# EAGLE design utilidong-butt-mk-1.1 (EAGLE 6.5.0)
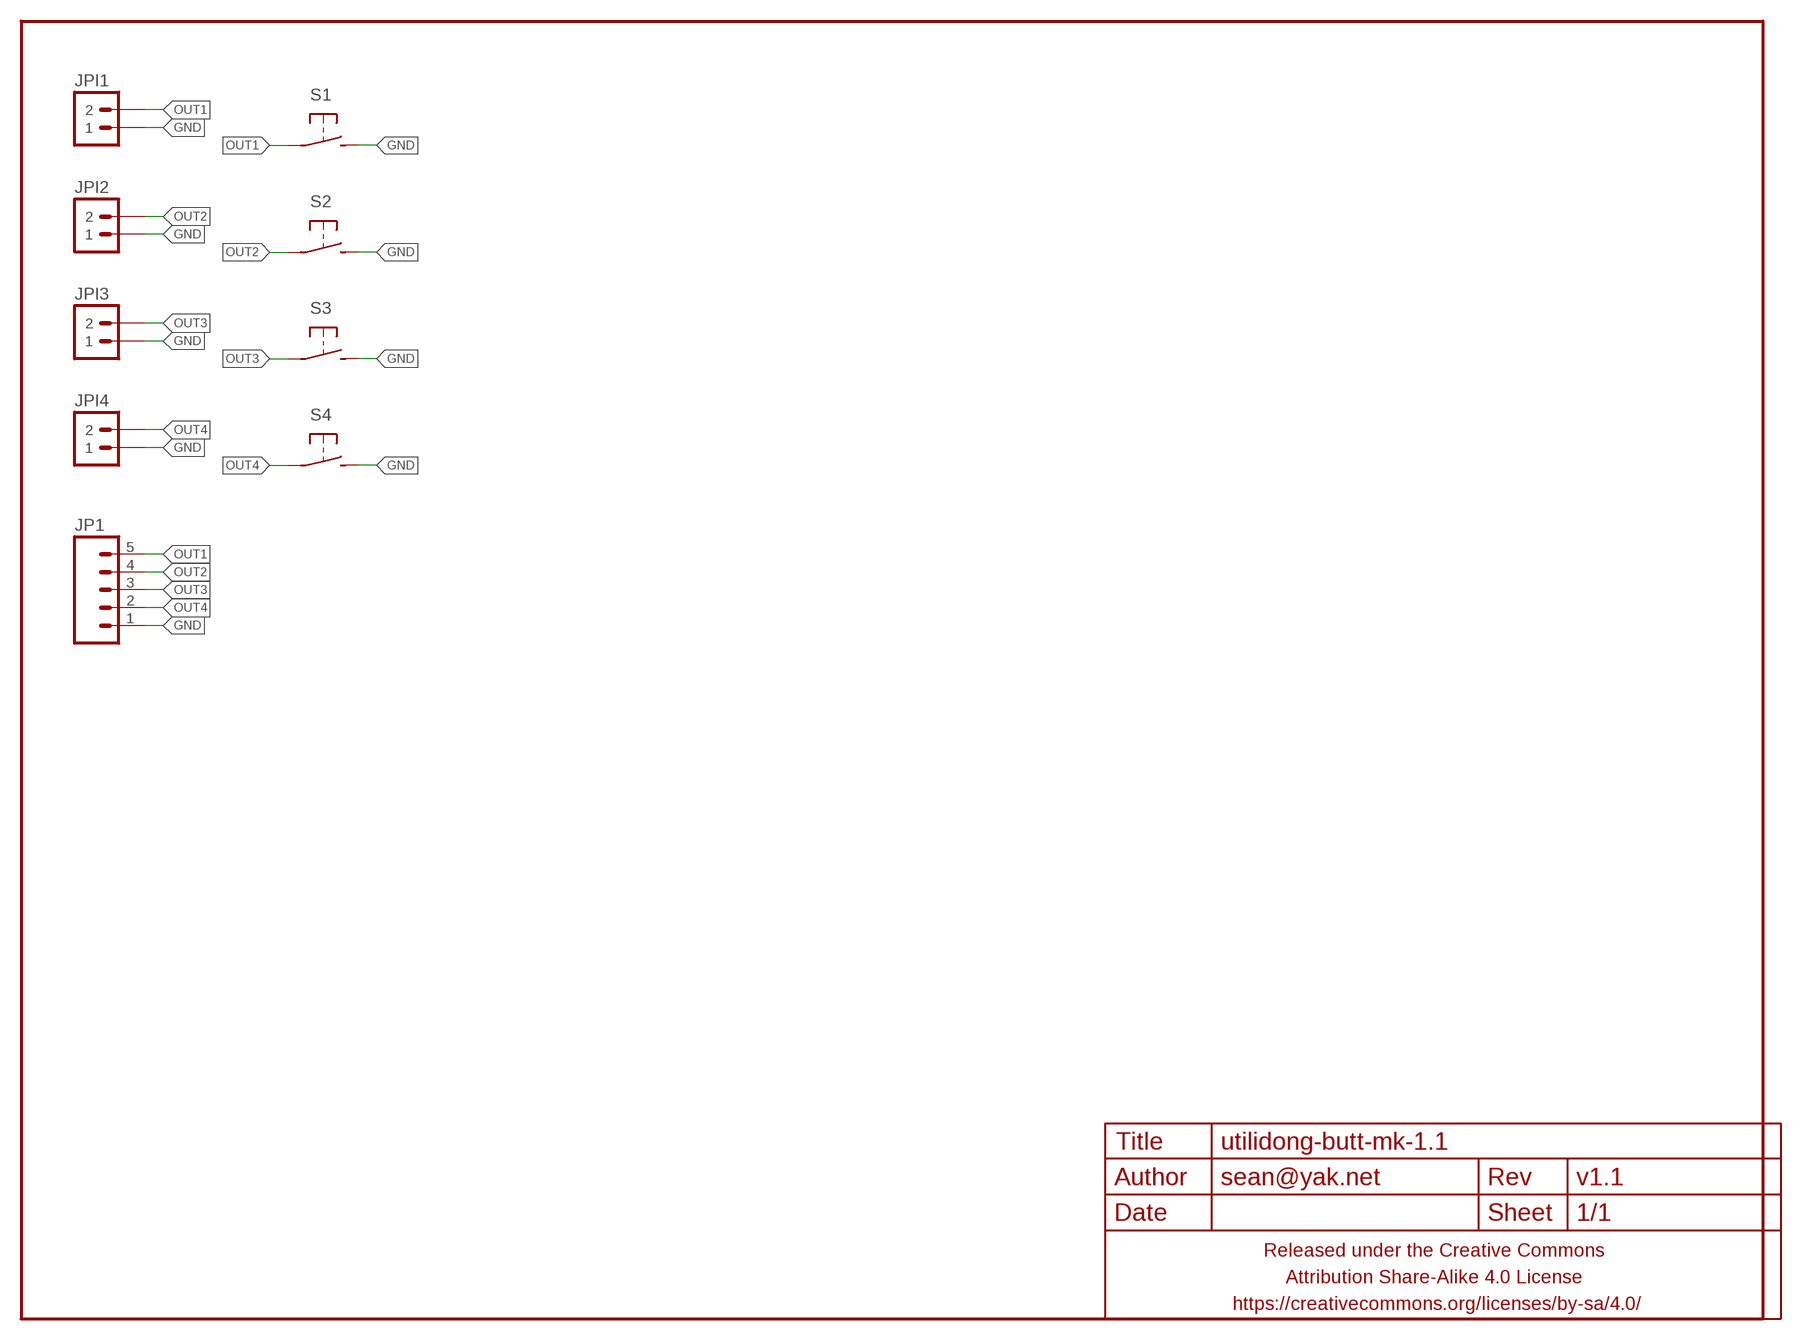
[diagram p0: schematic, sheet 1]

## Parts
FRAME1  FRAME-LETTERNO_PACKAGE  [DUMMY]
JP1  M05JST-PH-VERT-PTH  [JST-5-PH-VERT-PTH]
JPI1  M02PTH-CENTERED  [1X02-CENTER]
JPI2  M02PTH-CENTERED  [1X02-CENTER]
JPI3  M02PTH-CENTERED  [1X02-CENTER]
JPI4  M02PTH-CENTERED  [1X02-CENTER]
S1  SPST-NO-TACT6MM-PTH-SMALL-PADS  [DTS-6-SMALL-PADS]
S2  SPST-NO-TACT6MM-PTH-SMALL-PADS  [DTS-6-SMALL-PADS]
S3  SPST-NO-TACT6MM-PTH-SMALL-PADS  [DTS-6-SMALL-PADS]
S4  SPST-NO-TACT6MM-PTH-SMALL-PADS  [DTS-6-SMALL-PADS]

## Nets
GND: JP1.1 JPI1.1 JPI2.1 JPI3.1 JPI4.1 S1.3 S1.4 S2.3 S2.4 S3.3 S3.4 S4.3 S4.4
OUT1: JP1.5 JPI1.2 S1.1 S1.2
OUT2: JP1.4 JPI2.2 S2.1 S2.2
OUT3: JP1.3 JPI3.2 S3.1 S3.2
OUT4: JP1.2 JPI4.2 S4.1 S4.2

## Library data of the parts
FRAME1 = A_butts:FRAME-LETTER: Schematic Frame Standard 8.5x11 US Letter frame; DESIGNER: sean@yak.net; VERSION: v1.1
JP1 = A_butts:M05: Header 5 Standard 5-pin 0.1" header. Use with straight break away headers (SKU : PRT-00116), right angle break away headers (PRT-00553), swiss pins (PRT-00743), machine pins (PRT-00117), and female headers (PRT-00115). Molex polarized connector foot print use with SKU : PRT-08230 with associated crimp pins and housings.
JPI1-JPI4 = A_butts:M02: Standard 2-pin 0.1" header. Use with - straight break away headers ( PRT-00116) - right angle break away headers (PRT-00553) - swiss pins (PRT-00743) - machine pins (PRT-00117) - female headers (PRT-00115) Molex polarized connector foot print use with: PRT-08233 with associated crimp pins and housings. 2.54_SCREWTERM for use with PRT-10571. 3.5mm Screw Terminal footprints for PRT-08084 5mm Screw Terminal footprints for use with PRT-08433
S1-S4 = A_butts:SPST-NO-TACT

## Board
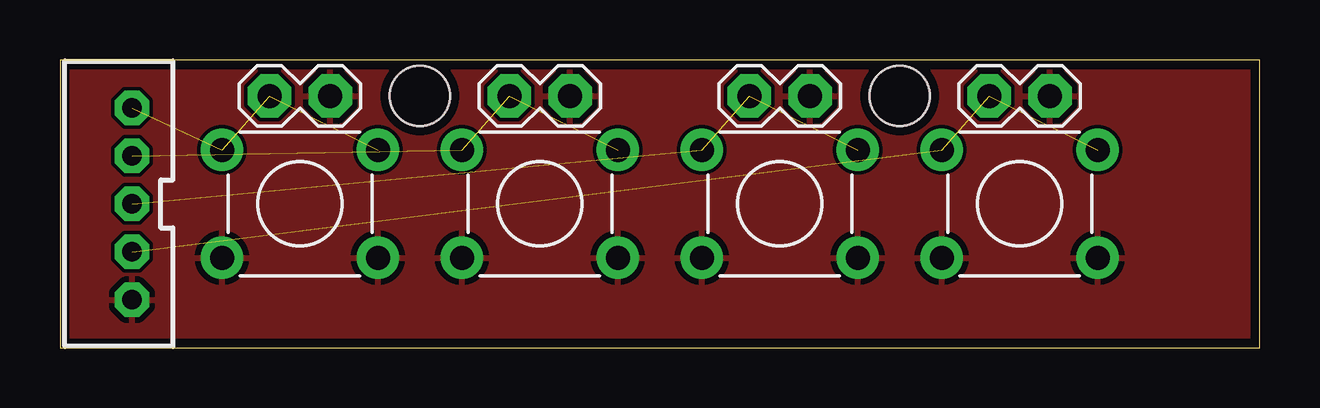
[diagram p1: board, top side]
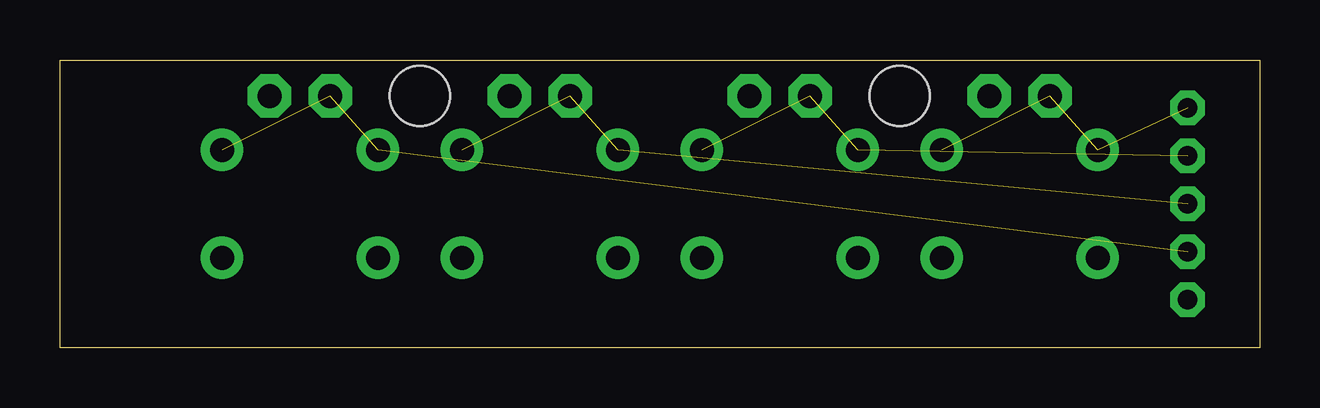
[diagram p2: board, bottom side, seen from below]

Size 50 x 12 mm. Coordinates in mm from the lower left corner, seen from the top.
Outline: 0,12 0,0 50,0 50,12 0,12
Copper layers (1*16): Top 0.0356mm / dielectric 1.5011mm / Bottom 0.0356mm
Design rules "LaenPCBOrder_2": minimum track width 6mil, minimum drill 13mil, track to track 6mil, track to pad 6mil, pad to pad 6mil, via to via 6mil, smd to smd 6mil, copper to edge 15mil, drill to drill 6mil, minimum pad ring 7mil, minimum via ring 7mil, stop-mask expansion 3mil, vias tented up to drill 20mil, thermal gap 10mil
Holes 2.5 mm at 15,10.5 35,10.5

### Footprints (pad centres in the part's own frame; a part is rotated, then mirrored left to right if it is on the bottom)
JST-5-PH-VERT-PTH = drill 0.8 pad 1.422 octagon: 1 -4,0; 2 -2,0; 3 0,0; 4 2,0; 5 4,0
1X02-CENTER = drill 1 pad 1.8 octagon: 1 -1.27,0; 2 1.27,0
DTS-6-SMALL-PADS = drill 1 pad 1.778: 1 -3.25,2.25; 2 3.25,2.25; 3 -3.25,-2.25; 4 3.25,-2.25

### Placement (x,y rotation side)
FRAME1  0,0 0 top
JP1  3,6 90 top
JPI1  10,10.5 180 top
JPI2  20,10.5 180 top
JPI3  30,10.5 180 top
JPI4  40,10.5 180 top
S1  10,6 0 top
S2  20,6 0 top
S3  30,6 0 top
S4  40,6 0 top

### Tracks (layer width: path | path; a pad name or v marks a point on that pad's centre or on a via)
GND
  pour Top: 0,0 0,12 50,12 50,0
OUT1  (3 unrouted)
OUT2  (3 unrouted)
OUT3  (3 unrouted)
OUT4  (3 unrouted)

### Text on the board
Bottom: Butt(on)
bPlace: Butt(on)